# Altium project Urukul.PrjPCB (part 5 of 11)

## Sheet Urukul_FPGA.SchDoc: =DocumentName
size A3; DocumentNumber: 1; Revision: 0; SheetNumber: 16; SheetTotal: 20; Version: 1.6; Author 1: Grzegorz Kasprowicz; Author 2: Filip Światkowski, Paweł Kulik, Maciej Przybysz; Author 3: Krzysztof Belewicz; Github: https://github.com/sinara-hw/Urukul; Last modified by: Krzysztof Belewicz
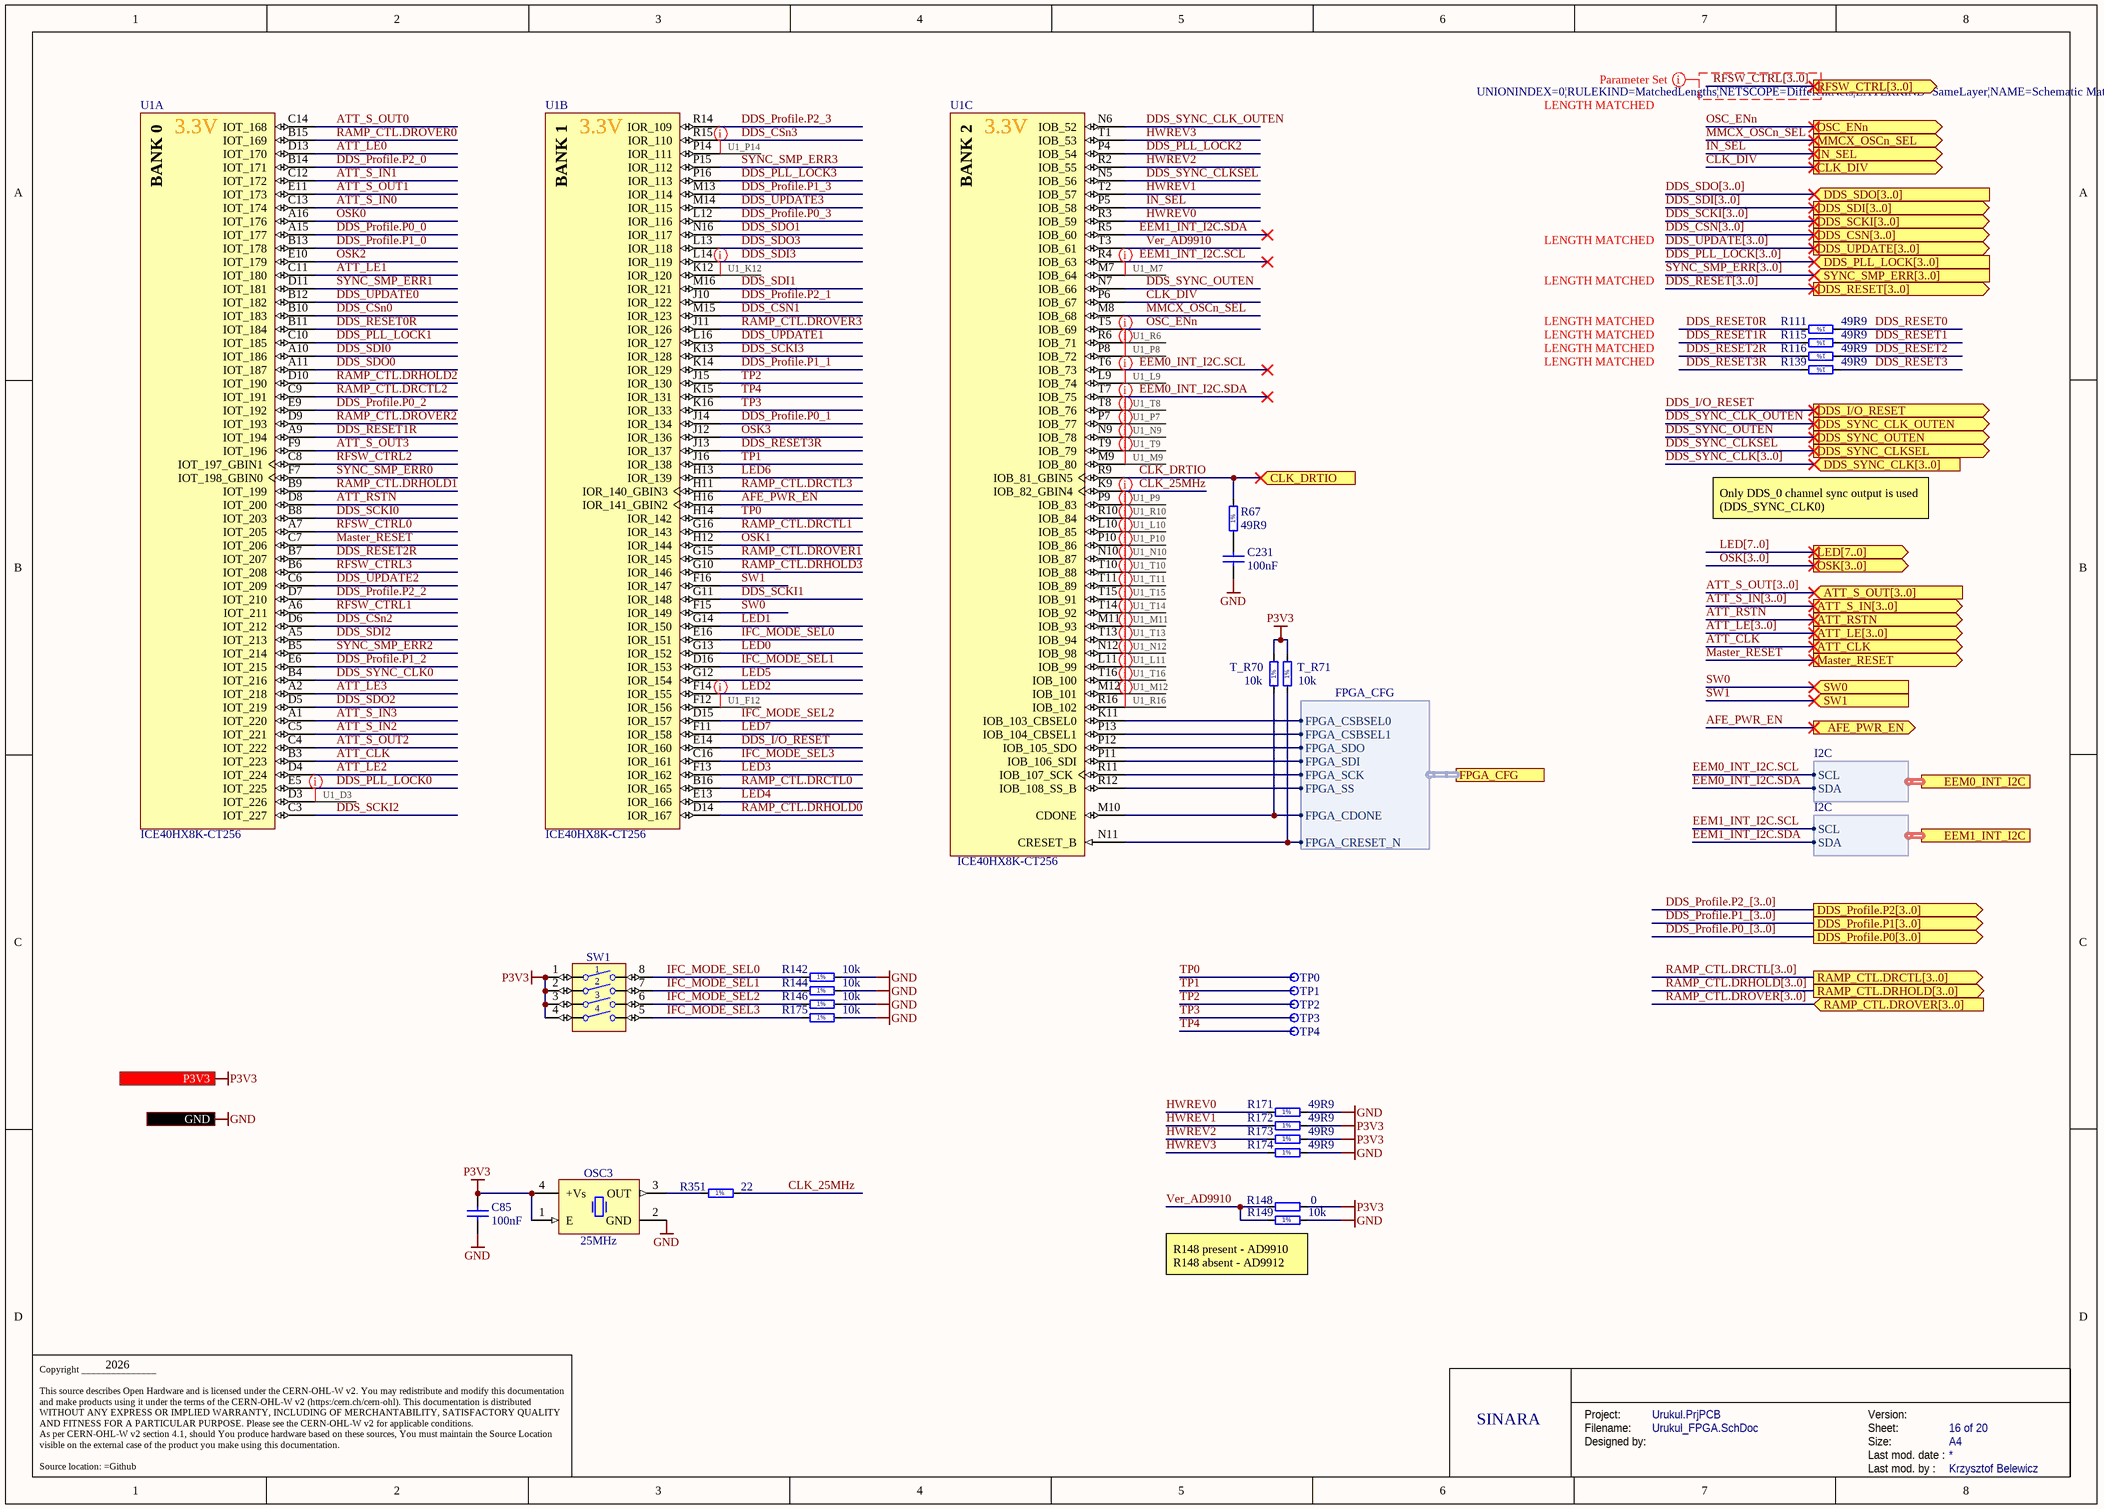
[diagram p11: Urukul_FPGA.SchDoc]

### Parts
C85  100nF  [CAPC1005X55N]
C231  100nF  [CAPC1005X55N]
OSC3  25MHz  [OSC_IQD_CFPS-39]
R67  49R9  [RESC1005X40N]
R111  49R9  [RESC1005X40N]
R115  49R9  [RESC1005X40N]
R116  49R9  [RESC1005X40N]
R139  49R9  [RESC1005X40N]
R142  10k  [RESC1005X40N]
R144  10k  [RESC1005X40N]
R146  10k  [RESC1005X40N]
R148  0  [RESC1005X40N]
R149  10k  [RESC1005X40N]
R171  49R9  [RESC1005X40N]
R172  49R9  [RESC1005X40N]
R173  49R9  [RESC1005X40N]
R174  49R9  [RESC1005X40N]
R175  10k  [RESC1005X40N]
R351  22  [RESC1005X40N]
SW1  Switch  [SW_TYCO_1571983-4]  (value not drawn)
T_R70  10k  [RESC1005X40N]
T_R71  10k  [RESC1005X40N]
TP0  Test Point  [TPS127]  (value not drawn)  (no BOM)
TP1  Test Point  [TPS127]  (value not drawn)  (no BOM)
TP2  Test Point  [TPS127]  (value not drawn)  (no BOM)
TP3  Test Point  [TPS127]  (value not drawn)  (no BOM)
TP4  Test Point  [TPS127]  (value not drawn)  (no BOM)
U1  ICE40HX8K-CT256  [LATC-caBGA-256]  (parts A,B,C of 5)

### Ports
AFE_PWR_EN (out), ATT_CLK (out), ATT_LE[3..0] (out), ATT_RSTN (out), ATT_S_IN[3..0] (out), ATT_S_OUT[3..0] (in), CLK_DIV (out), CLK_DRTIO (in), DDS_CSN[3..0] (out), DDS_I/O_RESET (out), DDS_PLL_LOCK[3..0] (in), DDS_Profile.P0[3..0] (out), DDS_Profile.P1[3..0] (out), DDS_Profile.P2[3..0] (out), DDS_RESET[3..0] (out), DDS_SCKI[3..0] (out), DDS_SDI[3..0] (out), DDS_SDO[3..0] (in), DDS_SYNC_CLK[3..0] (in), DDS_SYNC_CLK_OUTEN (out), DDS_SYNC_CLKSEL (out), DDS_SYNC_OUTEN (out), DDS_UPDATE[3..0] (out), EEM0_INT_I2C (harness I2C), EEM1_INT_I2C (harness I2C), FPGA_CFG (harness FPGA_CFG), GND, IN_SEL (out), LED[7..0] (out), Master_RESET (out), MMCX_OSCn_SEL (out), OSC_ENn (out), OSK[3..0] (out), P3V3 (in), RAMP_CTL.DRCTL[3..0] (out), RAMP_CTL.DRHOLD[3..0] (out), RAMP_CTL.DROVER[3..0] (in), RFSW_CTRL[3..0] (out), SW0 (in), SW1 (in), SYNC_SMP_ERR[3..0] (in)

### Harnesses
FPGA_CFG: FPGA_CSBSEL0, FPGA_CSBSEL1, FPGA_SDO, FPGA_SDI, FPGA_SCK, FPGA_SS, FPGA_CDONE, FPGA_CRESET_N
I2C: SDA, SCL

### Nets
GND: C85.1 C231.1 OSC3.2(GND) R142.1 R144.1 R146.1 R149.1 R171.1 R174.1 R175.1 ; port GND
P3V3: C85.2 OSC3.1(E) OSC3.4(+Vs) R148.2 R172.1 R173.1 SW1.1 SW1.2 SW1.3 SW1.4 T_R70.2 T_R71.2 ; port P3V3
AFE_PWR_EN: U1.H16(IOR_141_GBIN2) ; port AFE_PWR_EN
ATT_CLK: U1.B3(IOT_223) ; port ATT_CLK
ATT_LE0: U1.D13(IOT_170)
ATT_LE1: U1.C11(IOT_180)
ATT_LE2: U1.D4(IOT_224)
ATT_LE3: U1.A2(IOT_218)
ATT_RSTn: U1.D8(IOT_200) ; port ATT_RSTN
ATT_S_IN0: U1.C13(IOT_174)
ATT_S_IN1: U1.C12(IOT_172)
ATT_S_IN2: U1.C5(IOT_221)
ATT_S_IN3: U1.A1(IOT_220)
ATT_S_OUT0: U1.C14(IOT_168)
ATT_S_OUT1: U1.E11(IOT_173)
ATT_S_OUT2: U1.C4(IOT_222)
ATT_S_OUT3: U1.F9(IOT_196)
CLK_25MHz: R351.2 U1.K9(IOB_82_GBIN4)
CLK_DIV: U1.P6(IOB_67) ; port CLK_DIV
CLK_DRTIO: R67.2 U1.R9(IOB_81_GBIN5) ; port CLK_DRTIO
DDS_CSn0: U1.B10(IOT_183)  [project net CSN]
DDS_CSN1: U1.M15(IOR_123)  [project net CSN]
DDS_CSn2: U1.D6(IOT_212)  [project net CSN]
DDS_CSn3: U1.R15(IOR_110)  [project net CSN]
DDS_I/O_RESET: U1.E14(IOR_160) ; port DDS_I/O_RESET
DDS_PLL_LOCK0: U1.E5(IOT_225)
DDS_PLL_LOCK1: U1.C10(IOT_185)
DDS_PLL_LOCK2: U1.P4(IOB_54)
DDS_PLL_LOCK3: U1.P16(IOR_113)
DDS_Profile.P0_0: U1.A15(IOT_177)  [project net DDS_Profile.P00]
DDS_Profile.P0_1: U1.J14(IOR_134)  [project net DDS_Profile.P01]
DDS_Profile.P0_2: U1.E9(IOT_192)  [project net DDS_Profile.P02]
DDS_Profile.P0_3: U1.L12(IOR_116)  [project net DDS_Profile.P03]
DDS_Profile.P1_0: U1.B13(IOT_178)  [project net DDS_Profile.P10]
DDS_Profile.P1_1: U1.K14(IOR_129)  [project net DDS_Profile.P11]
DDS_Profile.P1_2: U1.E6(IOT_215)  [project net DDS_Profile.P12]
DDS_Profile.P1_3: U1.M13(IOR_114)  [project net DDS_Profile.P13]
DDS_Profile.P2_0: U1.B14(IOT_171)  [project net DDS_Profile.P20]
DDS_Profile.P2_1: U1.J10(IOR_122)  [project net DDS_Profile.P21]
DDS_Profile.P2_2: U1.D7(IOT_210)  [project net DDS_Profile.P22]
DDS_Profile.P2_3: U1.R14(IOR_109)  [project net DDS_Profile.P23]
DDS_RESET0: R111.1
DDS_RESET0R: R111.2 U1.B11(IOT_184)
DDS_RESET1: R115.1
DDS_RESET1R: R115.2 U1.A9(IOT_194)
DDS_RESET2: R116.1
DDS_RESET2R: R116.2 U1.B7(IOT_207)
DDS_RESET3: R139.1
DDS_RESET3R: R139.2 U1.J13(IOR_137)
DDS_SCKI0: U1.B8(IOT_203)
DDS_SCKI1: U1.G11(IOR_148)
DDS_SCKI2: U1.C3(IOT_227)
DDS_SCKI3: U1.K13(IOR_128)
DDS_SDI0: U1.A10(IOT_186)
DDS_SDI1: U1.M16(IOR_121)
DDS_SDI2: U1.A5(IOT_213)
DDS_SDI3: U1.L14(IOR_119)
DDS_SDO0: U1.A11(IOT_187)
DDS_SDO1: U1.N16(IOR_117)
DDS_SDO2: U1.D5(IOT_219)
DDS_SDO3: U1.L13(IOR_118)
DDS_SYNC_CLK0: U1.B4(IOT_216)
DDS_SYNC_CLK_OUTEN: U1.N6(IOB_52) ; port DDS_SYNC_CLK_OUTEN
DDS_SYNC_CLKSEL: U1.N5(IOB_56) ; port DDS_SYNC_CLKSEL
DDS_SYNC_OUTEN: U1.N7(IOB_66) ; port DDS_SYNC_OUTEN
DDS_UPDATE0: U1.B12(IOT_182)
DDS_UPDATE1: U1.L16(IOR_127)
DDS_UPDATE2: U1.C6(IOT_209)
DDS_UPDATE3: U1.M14(IOR_115)
EEM0_INT_I2C.SCL: U1.T6(IOB_73) ; port EEM0_INT_I2C.SCL
EEM0_INT_I2C.SDA: U1.T7(IOB_75) ; port EEM0_INT_I2C.SDA
EEM1_INT_I2C.SCL: U1.R4(IOB_63) ; port EEM1_INT_I2C.SCL
EEM1_INT_I2C.SDA: U1.R5(IOB_60) ; port EEM1_INT_I2C.SDA
FPGA_CDONE: T_R70.1 U1.M10(CDONE) ; port FPGA_CFG.FPGA_CDONE
FPGA_CFG.FPGA_CRESET_N: T_R71.1 U1.N11(CRESET_B) ; port FPGA_CFG.FPGA_CRESET_N
FPGA_CFG.FPGA_CSBSEL0: U1.K11(IOB_103_CBSEL0) ; port FPGA_CFG.FPGA_CSBSEL0
FPGA_CFG.FPGA_CSBSEL1: U1.P13(IOB_104_CBSEL1) ; port FPGA_CFG.FPGA_CSBSEL1
FPGA_CFG.FPGA_SCK: U1.R11(IOB_107_SCK) ; port FPGA_CFG.FPGA_SCK
FPGA_CFG.FPGA_SDI: U1.P11(IOB_106_SDI) ; port FPGA_CFG.FPGA_SDI
FPGA_CFG.FPGA_SDO: U1.P12(IOB_105_SDO) ; port FPGA_CFG.FPGA_SDO
FPGA_CFG.FPGA_SS: U1.R12(IOB_108_SS_B) ; port FPGA_CFG.FPGA_SS
HWREV0: R171.2 U1.R3(IOB_59)
HWREV1: R172.2 U1.T2(IOB_57)
HWREV2: R173.2 U1.R2(IOB_55)
HWREV3: R174.2 U1.T1(IOB_53)
IFC_MODE_SEL0: R142.2 SW1.8 U1.E16(IOR_151)
IFC_MODE_SEL1: R144.2 SW1.7 U1.D16(IOR_153)
IFC_MODE_SEL2: R146.2 SW1.6 U1.D15(IOR_157)
IFC_MODE_SEL3: R175.2 SW1.5 U1.C16(IOR_161)
IN_SEL: U1.P5(IOB_58) ; port IN_SEL
LED0: U1.G13(IOR_152)
LED1: U1.G14(IOR_150)
LED2: U1.F14(IOR_155)
LED3: U1.F13(IOR_162)
LED4: U1.E13(IOR_166)
LED5: U1.G12(IOR_154)
LED6: U1.H13(IOR_139)
LED7: U1.F11(IOR_158)
Master_RESET: U1.C7(IOT_206) ; port Master_RESET
MMCX_OSCn_SEL: U1.M8(IOB_68) ; port MMCX_OSCn_SEL
OSC_ENn: U1.T5(IOB_69) ; port OSC_ENn
OSK0: U1.A16(IOT_176)
OSK1: U1.H12(IOR_144)  [project net OSK01]
OSK2: U1.E10(IOT_179)  [project net OSK02]
OSK3: U1.J12(IOR_136)  [project net OSK03]
RAMP_CTL.DRCTL0: U1.B16(IOR_165)
RAMP_CTL.DRCTL1: U1.G16(IOR_143)
RAMP_CTL.DRCTL2: U1.C9(IOT_191)
RAMP_CTL.DRCTL3: U1.H11(IOR_140_GBIN3)
RAMP_CTL.DRHOLD0: U1.D14(IOR_167)
RAMP_CTL.DRHOLD1: U1.B9(IOT_199)
RAMP_CTL.DRHOLD2: U1.D10(IOT_190)
RAMP_CTL.DRHOLD3: U1.G10(IOR_146)
RAMP_CTL.DROVER0: U1.B15(IOT_169)
RAMP_CTL.DROVER1: U1.G15(IOR_145)
RAMP_CTL.DROVER2: U1.D9(IOT_193)
RAMP_CTL.DROVER3: U1.J11(IOR_126)
RFSW_CTRL0: U1.A7(IOT_205)
RFSW_CTRL1: U1.A6(IOT_211)
RFSW_CTRL2: U1.C8(IOT_197_GBIN1)
RFSW_CTRL3: U1.B6(IOT_208)
SW0: U1.F15(IOR_149) ; port SW0
SW1: U1.F16(IOR_147) ; port SW1
SYNC_SMP_ERR0: U1.F7(IOT_198_GBIN0)
SYNC_SMP_ERR1: U1.D11(IOT_181)
SYNC_SMP_ERR2: U1.B5(IOT_214)
SYNC_SMP_ERR3: U1.P15(IOR_112)
TP0: TP0.1 U1.H14(IOR_142)
TP1: TP1.1 U1.J16(IOR_138)
TP2: TP2.1 U1.J15(IOR_130)
TP3: TP3.1 U1.K16(IOR_133)
TP4: TP4.1 U1.K15(IOR_131)
U1_D3: U1.D3(IOT_226)
U1_F12: U1.F12(IOR_156)
U1_K12: U1.K12(IOR_120)
U1_L9: U1.L9(IOB_74)
U1_L10: U1.L10(IOB_85)
U1_L11: U1.L11(IOB_99)
U1_M7: U1.M7(IOB_64)
U1_M9: U1.M9(IOB_80)
U1_M11: U1.M11(IOB_93)
U1_M12: U1.M12(IOB_101)
U1_N9: U1.N9(IOB_78)
U1_N10: U1.N10(IOB_87)
U1_N12: U1.N12(IOB_98)
U1_P7: U1.P7(IOB_77)
U1_P8: U1.P8(IOB_72)
U1_P9: U1.P9(IOB_83)
U1_P10: U1.P10(IOB_86)
U1_P14: U1.P14(IOR_111)
U1_R6: U1.R6(IOB_71)
U1_R10: U1.R10(IOB_84)
U1_R16: U1.R16(IOB_102)
U1_T8: U1.T8(IOB_76)
U1_T9: U1.T9(IOB_79)
U1_T10: U1.T10(IOB_88)
U1_T11: U1.T11(IOB_89)
U1_T13: U1.T13(IOB_94)
U1_T14: U1.T14(IOB_92)
U1_T15: U1.T15(IOB_91)
U1_T16: U1.T16(IOB_100)
Ver_AD9910: R148.1 R149.2 U1.T3(IOB_61)
NetC231_2: C231.2 R67.1
NetOSC3_3: OSC3.3(OUT) R351.1

### Buses and harness runs
bus ATT_LE[3..0] = port ATT_LE[3..0]
bus ATT_S_IN[3..0] = port ATT_S_IN[3..0]
bus ATT_S_OUT[3..0] = port ATT_S_OUT[3..0]
bus DDS_CSN[3..0] = port DDS_CSN[3..0]
bus DDS_PLL_LOCK[3..0] = port DDS_PLL_LOCK[3..0]
bus DDS_Profile.P0_[3..0] = port DDS_Profile.P0[3..0]
bus DDS_Profile.P1_[3..0] = port DDS_Profile.P1[3..0]
bus DDS_Profile.P2_[3..0] = port DDS_Profile.P2[3..0]
bus DDS_RESET[3..0] = port DDS_RESET[3..0]
bus DDS_SCKI[3..0] = port DDS_SCKI[3..0]
bus DDS_SDI[3..0] = port DDS_SDI[3..0]
bus DDS_SDO[3..0] = port DDS_SDO[3..0]
bus DDS_SYNC_CLK[3..0] = port DDS_SYNC_CLK[3..0]
bus DDS_UPDATE[3..0] = port DDS_UPDATE[3..0]
bus LED[7..0] = port LED[7..0]
bus OSK[3..0] = port OSK[3..0]
bus RAMP_CTL.DRCTL[3..0] = port RAMP_CTL.DRCTL[3..0]
bus RAMP_CTL.DRHOLD[3..0] = port RAMP_CTL.DRHOLD[3..0]
bus RAMP_CTL.DROVER[3..0] = port RAMP_CTL.DROVER[3..0]
bus RFSW_CTRL[3..0] = port RFSW_CTRL[3..0]
bus SYNC_SMP_ERR[3..0] = port SYNC_SMP_ERR[3..0]

### Layout directives
rule Matched Net Lengths [Tolerance = 2.54mm]; net class RFSW: RFSW_CTRL[3..0]
net class Unused: U1_D3, U1_F12, U1_K12, U1_L9, U1_L10, U1_L11, U1_M7, U1_M9, U1_M11, U1_M12, U1_N9, U1_N10, U1_N12, U1_P7, U1_P8, U1_P9, U1_P10, U1_P14, U1_R6, U1_R10, U1_R16, U1_T8, U1_T9, U1_T10, U1_T11, U1_T13, U1_T14, U1_T15, U1_T16

### Notes on the sheet
- LENGTH MATCHED
- 3.3V
- Only DDS_0 channel sync output is used (DDS_SYNC_CLK0)
- (near R149) R148 present - AD9910
  R148 absent - AD9912
- 2026
- SINARA
- Project:
- Designed by:
- Filename:
- Size:
- Version:
- Last mod. date :
- Sheet:
- A4
- Copyright _______________
  This source describes Open Hardware and is licensed under the CERN-OHL-W v2. You may redistribute and modify this documentation and make products using it under the terms of the CERN-OHL-W v2 (https:/cern.ch/cern-ohl). This documentation is distributed WITHOUT ANY EXPRESS OR IMPLIED WARRANTY, INCLUDING OF MERCHANTABILITY, SATISFACTORY QUALITY AND FITNESS FOR A PARTICULAR PURPOSE. Please see the CERN-OHL-W v2 for applicable conditions.
  As per CERN-OHL-W v2 section 4.1, should You produce hardware based on these sources, You must maintain the Source Location visible on the external case of the product you make using this documentation.
  Source location: =Github
- Last mod. by :
- (in symbol CMP-0962-00001-1, part A) BANK 0
- (in symbol CMP-0962-00001-1, part B) BANK 1
- (in symbol CMP-0962-00001-1, part C) BANK 2
- (in symbol R0402_10K_1%_0.0625W_100PPM) 1%
- (in symbol R0402_22R_1%_0.0625W_100PPM) 1%
- (in symbol R0402_49R9_1%_0.0625W_100PPM) 1%

### Library data of the parts
C85 C231 = CC0402_100NF_16V_10%_X5R: Non-polarised capacitor; Part Description: SMD Multilayer Chip Ceramic Capacitor; Manufacturer: GENERIC; Manufacturer1 Part Number: GRM155R61C104KA88D; Voltage: 16V; TC: X5R; Tolerance: ±10%; Part Number: CC0402_100NF_16V_10%_X5R; Component Kind: Standard; Component Type: Standard; Pin Count: 2; Value: 100nF; Status: None; Manufacturer Part Number: CC0402_100NF_16V_10%_X5R; Case: 0402; Mounted: Yes; Socket: No; SMD: Yes; Sense: No; Manufacturer1 Example: MURATA; Manufacturer1 ComponentHeight: 0.55mm; HelpURL: \\cern.ch\dfs\Applications\Altium\Datasheets\CC0402_X5R_MURATA_GRM.pdf; Author: CERN DEM JLC; CreateDate: 10.12.2013; LatestRevisionDate: 10.12.2013
OSC3 = OSC_25MHZ_IQD_LFSPXO025165: Oscillator 4 pins 1=E 2=GND 3=OUT 4=+Vs; Part Description: 3.3V, ±50ppm, 15pF, -40 to 85°C, CMOS Surface Mount Clock Oscillator (CFPS-39 Series); Manufacturer: IQD FREQUENCY PRODUCTS; PressFit: No; Bonding: No; Part Number: OSC_25MHZ_IQD_LFSPXO025165; Component Kind: Standard; Component Type: Standard; PackageDescription: Oscillator, Corner Concave, 2.20mm Pitch, 4 Pins, 2.70mm L X 3.40mm W X 1.20mm H, CFPS-39 Series; Value: 25MHz; Manufacturer Part Number: LFSPXO025165; Pin Count: 4; Mounted: Yes; Socket: No; SMD: Yes; Sense: No; ComponentHeight: 1.2mm; HelpURL: \\cern.ch\dfs\Applications\Altium\Datasheets\OSC_IQD_LFSPXO025165.pdf; Author: CERN DEM JLC; CreateDate: 02.12.2010; LatestRevisionDate: 03.11.2016
R67 R111 R115 R116 R139 R171-R174 = R0402_49R9_1%_0.0625W_100PPM: Resistor - 1%; Part Description: General Purpose Thick Film Chip Resistor; Manufacturer: GENERIC; Manufacturer1 Part Number: 232270674999L or RC0402FR-0749R9L; TC: ±100ppm/°C; PressFit: No; Part Number: R0402_49R9_1%_0.0625W_100PPM; Component Kind: Standard; Component Type: Standard; Pin Count: 2; Value: 49R9; Status: Not Recommended; Power: 0.0625W; Tolerance: ±1%; Manufacturer Part Number: R0402_49R9_1%_0.0625W_100PPM; Case: 0402; Mounted: Yes; Sense: No; Socket: No; SMD: Yes; Manufacturer1 Example: YAGEO PHYCOMP; Manufacturer1 ComponentHeight: 0.4mm; HelpURL: \\cern.ch\dfs\Applications\Altium\Datasheets\R0402_Phycomp_RC0402.pdf; Author: CERN DEM JLC; CreateDate: 24.10.2012; LatestRevisionDate: 24.10.2012
R142 R144 R146 R149 R175 = R0402_10K_1%_0.0625W_100PPM: Resistor - 1%; Part Description: General Purpose Thick Film Chip Resistor; Manufacturer: GENERIC; Manufacturer1 Part Number: 232270671003L; TC: ±100ppm/°C; Part Number: R0402_10K_1%_0.0625W_100PPM; Component Kind: Standard; Component Type: Standard; Pin Count: 2; Value: 10k; Status: Not recommended; Power: 0.0625W; Tolerance: ±1%; Manufacturer Part Number: R0402_10K_1%_0.0625W_100PPM; Case: 0402; Mounted: Yes; Sense: No; Socket: No; SMD: Yes; Manufacturer1 Example: YAGEO PHYCOMP; Manufacturer1 ComponentHeight: 0.4mm; HelpURL: \\cern.ch\dfs\Applications\Altium\Datasheets\R0402_Phycomp_RC0402.pdf; Author: CERN DEM JLC; CreateDate: 03.12.2007; LatestRevisionDate: 17.10.2012
R148 = R0402_0R_JUMPER: Resistor; Part Description: 1A (0.05R Max DC Resistance) Zero Ohm Jumper; Manufacturer: GENERIC; Manufacturer1 Part Number: 232270591001L; Part Number: R0402_0R_JUMPER; Component Kind: Standard; Component Type: Standard; Pin Count: 2; Value: 0; Status: Not recommended; Manufacturer Part Number: R0402_0R_JUMPER; Case: 0402; Mounted: Yes; Sense: No; Socket: No; SMD: Yes; Manufacturer1 Example: YAGEO PHYCOMP; Manufacturer1 ComponentHeight: 0.4mm; HelpURL: \\cern.ch\dfs\Applications\Altium\Datasheets\R0402_Phycomp_RC0402.pdf; Author: CERN DEM JLC; CreateDate: 2007-12-03; LatestRevisionDate: 2012-10-17
R351 = R0402_22R_1%_0.0625W_100PPM: Resistor - 1%; Part Description: General Purpose Thick Film Chip Resistor; Manufacturer: GENERIC; Manufacturer1 Part Number: 232270672209L; TC: ±100ppm/°C; PressFit: No; Part Number: R0402_22R_1%_0.0625W_100PPM; Component Kind: Standard; Component Type: Standard; Pin Count: 2; Value: 22; Status: Not Recommended; Power: 0.0625W; Tolerance: ±1%; Manufacturer Part Number: R0402_22R_1%_0.0625W_100PPM; Case: 0402; Mounted: Yes; Sense: No; Socket: No; SMD: Yes; Manufacturer1 Example: YAGEO PHYCOMP; Manufacturer1 ComponentHeight: 0.4mm; HelpURL: \\cern.ch\dfs\Applications\Altium\Datasheets\R0402_Phycomp_RC0402.pdf; Author: CERN DEM JLC; CreateDate: 03/12/2007; LatestRevisionDate: 17/10/2012
SW1 = SW_TYCO_1571983-4: 4 Ways SPST DIP Switch; Part Description: 4 Way SPST SMD DIP Switch, Latched, Contact Rating 0.025A 24VDC; Manufacturer: TYCO; Manufacturer Part Number: 1571983-4 or GDH04S04; PressFit: No; Part Number: SW_TYCO_1571983-4; Component Kind: Standard; Component Type: Standard; Pin Count: 8; PackageDescription: Pitch 1.27mm,  Body 6.2x6.2mm, 4 Ways SPST Surface-Mount DIP Switch, TYCO GDH Series; Family: Switch; Mounted: Yes; Socket: No; SMD: Yes; Sense: No; Status: None; ComponentHeight: 2.31mm; HelpURL: \\cern.ch\dfs\Applications\Altium\Datasheets\SW_TYCO_1571983-4.pdf; Author: CERN DEM JLC; CreateDate: 08/01/2009; LatestRevisionDate: 08/01/2009
T_R70 T_R71 = R0402_10K_1%_0.0625W_100PPM: Resistor - 1%; Part Description: General Purpose Thick Film Chip Resistor; Manufacturer: GENERIC; Manufacturer1 Part Number: 232270671003L; TC: ±100ppm/°C; PressFit: No; Part Number: R0402_10K_1%_0.0625W_100PPM; Component Kind: Standard; Component Type: Standard; Pin Count: 2; Value: 10k; Status: Not Recommended; Power: 0.0625W; Tolerance: ±1%; Manufacturer Part Number: R0402_10K_1%_0.0625W_100PPM; Case: 0402; Mounted: Yes; Sense: No; Socket: No; SMD: Yes; Manufacturer1 Example: YAGEO PHYCOMP; Manufacturer1 ComponentHeight: 0.4mm; HelpURL: \\cern.ch\dfs\Applications\Altium\Datasheets\R0402_Phycomp_RC0402.pdf; Author: CERN DEM JLC; CreateDate: 03.12.2007; LatestRevisionDate: 17.10.2012
TP0-TP4 = SMD_PAD_1.27X1.27MM: Part Description: 1.27mm x 1.27mm PCB Copper Area (SMD Test Point); Mounted: No; Part Number: SMD_PAD_1.27X1.27MM; Component Type: Standard (No BOM); Pin Count: 1; Family: Test Point; Socket: No; SMD: Yes; Sense: No; Status: None; ComponentHeight: 0mm; HelpURL: Undefined; Author: CERN DEM JLC; CreateDate: 12.01.2008; LatestRevisionDate: 12.01.2008; PackageDescription: 1.27mm x 1.27mm PCB Copper Area (SMD Test Point)
U1 = CMP-0962-00001-1: iCE40 HX8K Series FPGA Family, 7680 Logic Cells, 1.2 V Core, 128 K Embedded RAM Bits, 256-ball caBGA, Pb-Free, Tray; Manufacturer: Lattice Semiconductor; Supply Voltage: 1.2V; Phase-Locked Loops: 2; Logic Cells: 7680; Embedded RAM Bits: 128K; PackageReference: caBGA-256; PackageDescription: 256-Ball Chip Array Ball Grid Array, Body 14 x 14 mm, Pitch 0.8 mm; RoHS: TRUE; Packing: Tray; Mounting Technology: Surface Mount; ComponentLink3URL: http://www.latticesemi.com/lit/docs/package/pkg.pdf; ComponentLink1Description: Manufacturer URL; ComponentLink3Description: Package Specification; Code_JEDEC: MO-275; PackageVersion: Rev. 03.9, 02/2013; ComponentLink1URL: http://www.latticesemi.com/en; ComponentLink2URL: http://www.latticesemi.com/~/media/Documents/DataSheets/iCE/iCE40LPHXFamilyDataSheet.pdf; Manufacturer Part Number: ICE40HX8K-CT256; ComponentLink2Description: Datasheet; DatasheetVersion: Rev. 02.9; Part Number: ICE40HX8K-CT256

## Sheet CLK_SYNC.SchDoc: =DocumentName
size A4; DocumentNumber: 1; Revision: 0; SheetNumber: 14; SheetTotal: 19; Version: 1.6; Author 1: Grzegorz Kasprowicz; Author 2: Filip Światkowski, Paweł Kulik, Maciej Przybysz; Author 3: Krzysztof Belewicz; Github: https://github.com/sinara-hw/Urukul; Last modified by: Maciej Przybysz
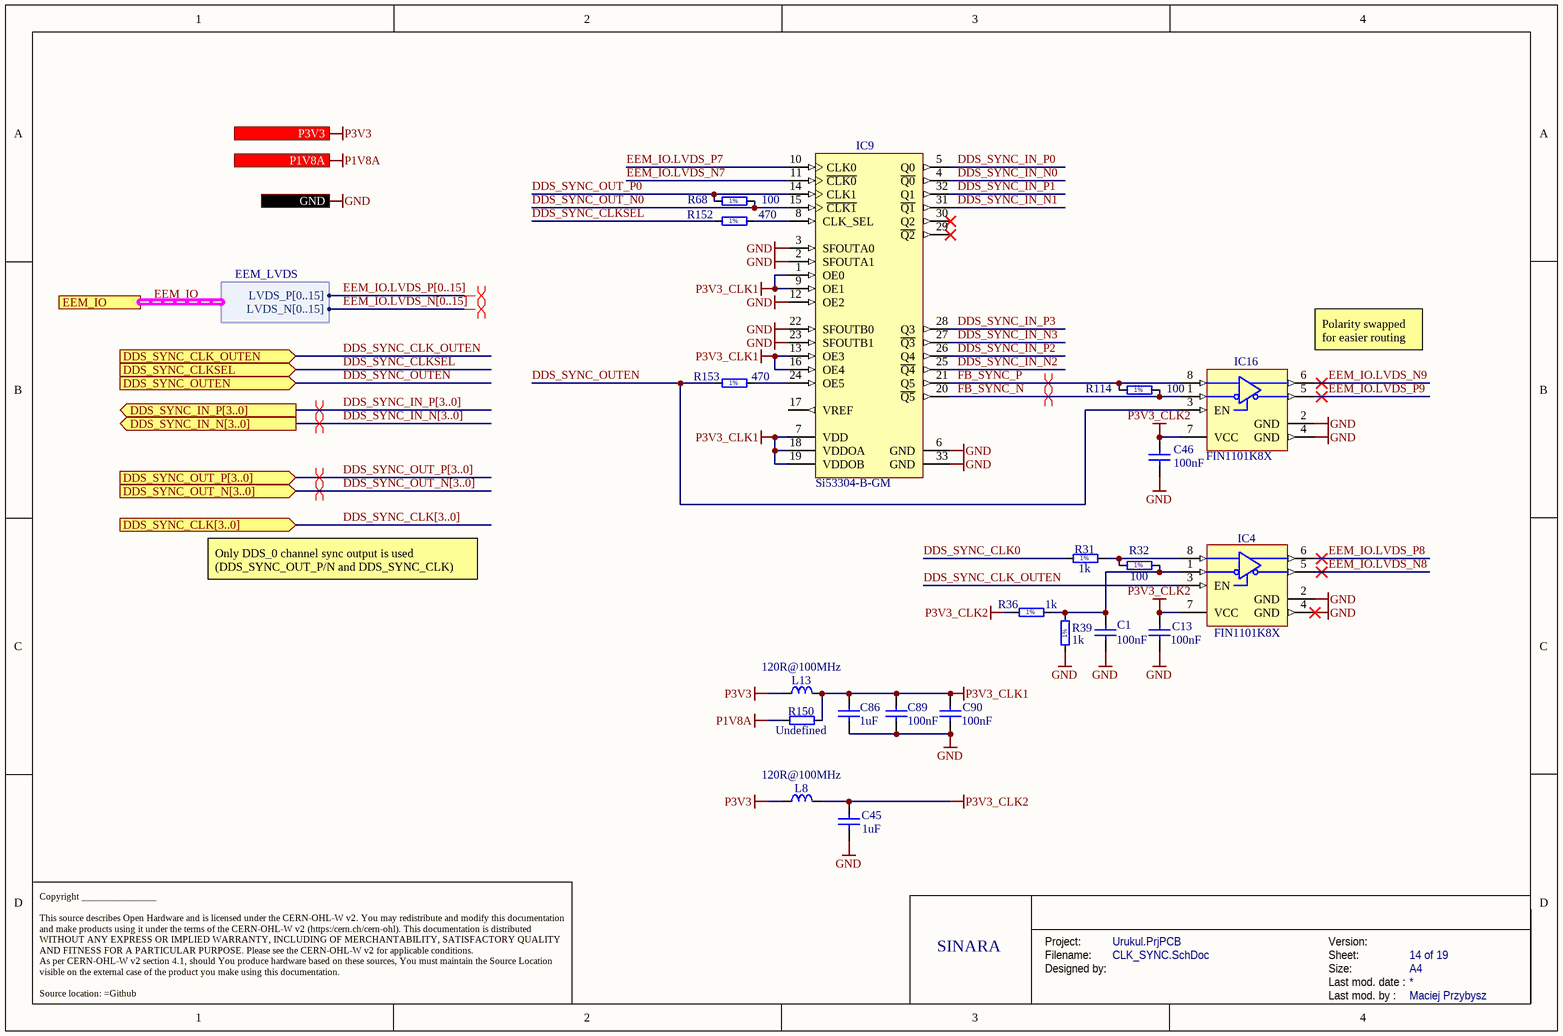
[diagram p12: CLK_SYNC.SchDoc]

### Parts
C1  100nF  [CAPC1005X55N]
C13  100nF  [CAPC1005X55N]
C45  1uF  [CAPC1005X55N]
C46  100nF  [CAPC1005X55N]
C86  1uF  [CAPC1005X55N]
C89  100nF  [CAPC1005X55N]
C90  100nF  [CAPC1005X55N]
IC4  FIN1101K8X  [SOP50P310X90-8N]
IC9  Si53304-B-GM  [SLAB-QFN-32-2150x2150TP_M]
IC16  FIN1101K8X  [SOP50P310X90-8N]
L8  120R@100MHz  [INDC1608X95N]
L13  120R@100MHz  [INDC1608X95N]
R31  1k  [RESC1005X40N]
R32  100  [RESC1005X40N]
R36  1k  [RESC1005X40N]
R39  1k  [RESC1005X40N]
R68  100  [RESC1005X40N]
R114  100  [RESC1005X40N]
R150  Undefined  [RESC1608X55N]
R152  470  [RESC1005X40N]
R153  470  [RESC1005X40N]

### Ports
DDS_SYNC_CLK[3..0] (in), DDS_SYNC_CLK_OUTEN (in), DDS_SYNC_CLKSEL (in), DDS_SYNC_IN_N[3..0] (out), DDS_SYNC_IN_P[3..0] (out), DDS_SYNC_OUT_N[3..0] (in), DDS_SYNC_OUT_P[3..0] (in), DDS_SYNC_OUTEN (in), EEM_IO (harness EEM_LVDS), GND, P1V8A (in), P3V3 (in)

### Harnesses
EEM_LVDS: LVDS_P[0..15], LVDS_N[0..15]

### Nets
GND: C1.1 C13.1 C45.1 C46.1 C86.1 C89.1 C90.1 IC4.2(GND) IC4.4(GND) IC9.2(SFOUTA1) IC9.3(SFOUTA0) IC9.6(GND) IC9.12(OE2) IC9.22(SFOUTB0) IC9.23(SFOUTB1) IC9.33(GND) IC16.2(GND) IC16.4(GND) R39.1 ; port GND
P1V8A: R150.1 ; port P1V8A
P3V3: L8.2 L13.2 ; port P3V3
P3V3_CLK1: C86.2 C89.2 C90.2 IC9.1(OE0) IC9.7(VDD) IC9.9(OE1) IC9.13(OE3) IC9.16(OE4) IC9.18(VDDOA) IC9.19(VDDOB) L13.1 R150.2
P3V3_CLK2: C13.2 C45.2 C46.2 IC4.7(VCC) IC16.7(VCC) L8.1 R36.1
DDS_SYNC_CLK0: R31.1
DDS_SYNC_CLK_OUTEN: IC4.3(EN) ; port DDS_SYNC_CLK_OUTEN
DDS_SYNC_CLKSEL: R152.1 ; port DDS_SYNC_CLKSEL
DDS_SYNC_IN_N0: IC9.4(~{Q0})
DDS_SYNC_IN_N1: IC9.31(~{Q1})
DDS_SYNC_IN_N2: IC9.25(~{Q4})
DDS_SYNC_IN_N3: IC9.27(~{Q3})
DDS_SYNC_IN_P0: IC9.5(Q0)
DDS_SYNC_IN_P1: IC9.32(Q1)
DDS_SYNC_IN_P2: IC9.26(Q4)
DDS_SYNC_IN_P3: IC9.28(Q3)
DDS_SYNC_OUT_N0: IC9.15(~{CLK1}) R68.2
DDS_SYNC_OUT_P0: IC9.14(CLK1) R68.1
DDS_SYNC_OUTEN: IC16.3(EN) R153.1 ; port DDS_SYNC_OUTEN
EEM_IO.LVDS_N7: IC9.11(~{CLK0})
EEM_IO.LVDS_N8: IC4.5(DOUT-)
EEM_IO.LVDS_N9: IC16.6(DOUT+)
EEM_IO.LVDS_P7: IC9.10(CLK0)
EEM_IO.LVDS_P8: IC4.6(DOUT+)
EEM_IO.LVDS_P9: IC16.5(DOUT-)
FB_SYNC_N: IC9.20(~{Q5}) IC16.1(RIN-) R114.2
FB_SYNC_P: IC9.21(Q5) IC16.8(RIN+) R114.1
NetC1_2: C1.2 IC4.1(RIN-) R32.2 R36.2 R39.2
NetIC4_8: IC4.8(RIN+) R31.2 R32.1
NetIC9_8: IC9.8(CLK_SEL) R152.2
NetIC9_24: IC9.24(OE5) R153.2

Not connected (* = marked no-connect by the designer): IC9 17(VREF) 29(~{Q2})* 30(Q2)*

### Buses and harness runs
bus DDS_SYNC_CLK[3..0] = port DDS_SYNC_CLK[3..0]
bus DDS_SYNC_IN_N[3..0] = port DDS_SYNC_IN_N[3..0]
bus DDS_SYNC_IN_P[3..0] = port DDS_SYNC_IN_P[3..0]
bus DDS_SYNC_OUT_N[3..0] = port DDS_SYNC_OUT_N[3..0]
bus DDS_SYNC_OUT_P[3..0] = port DDS_SYNC_OUT_P[3..0]
bus EEM_IO.LVDS_N[0..15]
bus EEM_IO.LVDS_P[0..15]
harness EEM_IO = port EEM_IO

### Layout directives
differential pair; differential pair class Diff_100Ohm: (no net found under the mark)
differential pair: (no net found under the mark), FB_SYNC_N, FB_SYNC_P

### Notes on the sheet
- (near IC16) Polarity swapped for easier routing
- Only DDS_0 channel sync output is used (DDS_SYNC_OUT_P/N and DDS_SYNC_CLK)
- SINARA
- Project:
- Designed by:
- Filename:
- Size:
- Version:
- Last mod. date :
- Sheet:
- A4
- Copyright _______________
  This source describes Open Hardware and is licensed under the CERN-OHL-W v2. You may redistribute and modify this documentation and make products using it under the terms of the CERN-OHL-W v2 (https:/cern.ch/cern-ohl). This documentation is distributed WITHOUT ANY EXPRESS OR IMPLIED WARRANTY, INCLUDING OF MERCHANTABILITY, SATISFACTORY QUALITY AND FITNESS FOR A PARTICULAR PURPOSE. Please see the CERN-OHL-W v2 for applicable conditions.
  As per CERN-OHL-W v2 section 4.1, should You produce hardware based on these sources, You must maintain the Source Location visible on the external case of the product you make using this documentation.
  Source location: =Github
- Last mod. by :
- (in symbol R0402_1K_1%_0.0625W_100PPM) 1%
- (in symbol R0402_100R_1%_0.0625W_100PPM) 1%
- (in symbol R0402_470R_1%_0.0625W_100PPM) 1%

### Library data of the parts
C1 C13 C46 C89 C90 = CC0402_100NF_16V_10%_X5R: as C85 on sheet Urukul_FPGA; Part Number: CC0402_100NF_16V_10%_X5R; Component Kind: Standard; Component Type: Standard; Pin Count: 2; Value: 100nF; Status: None; Manufacturer Part Number: CC0402_100NF_16V_10%_X5R; Case: 0402; Mounted: Yes; Socket: No; SMD: Yes; Sense: No; Manufacturer1 Example: MURATA; Manufacturer1 ComponentHeight: 0.55mm; HelpURL: \\cern.ch\dfs\Applications\Altium\Datasheets\CC0402_X5R_MURATA_GRM.pdf; Author: CERN DEM JLC; CreateDate: 10.12.2013; LatestRevisionDate: 10.12.2013
C45 C86 = CC0402_1UF_16V_10%_X5R: Non-polarised capacitor; Part Description: SMD Multilayer Chip Ceramic Capacitor; Manufacturer: GENERIC; Manufacturer1 Part Number: C1005X5R1C105KT; Voltage: 16V; TC: X5R; Tolerance: ±10%; Part Number: CC0402_1UF_16V_10%_X5R; Component Kind: Standard; Component Type: Standard; Pin Count: 2; Value: 1uF; Status: Preferred; Manufacturer Part Number: CC0402_1UF_16V_10%_X5R; Case: 0402; Mounted: Yes; Socket: No; SMD: Yes; Sense: No; Manufacturer1 Example: TDK; Manufacturer1 ComponentHeight: 0.55mm; HelpURL: \\cern.ch\dfs\Applications\Altium\Datasheets\CC0402_X5R_TDK_C.pdf; Author: CERN DEM JLC; CreateDate: 2012-10-25; LatestRevisionDate: 2012-10-25
IC4 IC16 = FIN1101K8X: LVDS Single Port High Speed Repeater; Manufacturer: FAIRCHILD SEMICONDUCTOR; PressFit: No; Bonding: No; Part Number: FIN1101K8X; Component Kind: Standard; Component Type: Standard; Device: FIN1101K8X; PackageDescription: SOP, 0.50mm Pitch; 8 pin, 2.30mm W X 2.00mm L X 0.90mm H body, PC Medium Density; Part Description: LVDS Single Port High Speed Repeater; Manufacturer Part Number: FIN1101K8X; Pin Count: 8; Case: TSSOP8; Mounted: Yes; Socket: No; SMD: Yes; Sense: No; ComponentHeight: 0.8mm; Author: CERN DEM JLC; HelpURL: \\cern.ch\dfs\Applications\Altium\Datasheets\FIN1101K8X.pdf; CreateDate: 08.11.2016; LatestRevisionDate: 08.11.2016
IC9 = CMP-0510-00277-1: 1:6 Low Jitter Universal Buffer / Level Translator with 2:1 Input Mux and Individual OE, 1 to 725 MHz, -40 to 85 degC, 32-pin QFN; Manufacturer: Silicon Labs; Sub-Family: Clock Buffers; Output Format: LVPECL; LVDS; CML; HCSL; LVCMOS; Frequency (MHz): 1 to 725; Mounting Technology: Surface Mount; Code_JEDEC: MO-220; Part Number: Si53304-B-GM; ComponentLink2URL: http://www.silabs.com/Support%20Documents/TechnicalDocs/Si53304.pdf; ComponentLink3URL: http://www.silabs.com/Support%20Documents/TechnicalDocs/Si53301.pdf; PackageDescription: 32-Pin Quad-Flat No-Leads Package, Body 5 x 5 mm, Pitch 0.5 mm; ComponentLink3Description: Package Specification; Code_IPC: J-STD-020; ComponentLink1Description: Manufacturer URL; ComponentLink2Description: Datasheet; ComponentLink1URL: http://www.silabs.com/; DatasheetVersion: Rev. 0.4; PackageReference: QFN-32
L8 L13 = IND0603_MURATA_BLM18PG121SN1D: Inductor; Part Description: SMD EMIFIL Chip Ferrite Bead; Manufacturer: MURATA; Power: 2A; Resistance: 0.05R; Part Number: IND0603_MURATA_BLM18PG121SN1D; Component Kind: Standard; Component Type: Standard; Pin Count: 2; Value: 120R@100MHz; Status: None; Manufacturer Part Number: BLM18PG121SN1D; Case: 0603; Mounted: Yes; Socket: No; SMD: Yes; Sense: No; ComponentHeight: 0.95mm; HelpURL: \\cern.ch\dfs\Applications\Altium\Datasheets\IND0603_MURATA_BLM18P.pdf; Author: CERN DEM BC; CreateDate: 2015-07-27; LatestRevisionDate: 2015-07-27
R31 R36 R39 = R0402_1K_1%_0.0625W_100PPM: Resistor - 1%; Part Description: General Purpose Thick Film Chip Resistor; Manufacturer: GENERIC; Manufacturer1 Part Number: 232270671002L; TC: ±100ppm/°C; PressFit: No; Part Number: R0402_1K_1%_0.0625W_100PPM; Component Kind: Standard; Component Type: Standard; Pin Count: 2; Value: 1k; Status: Not Recommended; Power: 0.0625W; Tolerance: ±1%; Manufacturer Part Number: R0402_1K_1%_0.0625W_100PPM; Case: 0402; Mounted: Yes; Socket: No; SMD: Yes; Manufacturer1 Example: YAGEO PHYCOMP; Manufacturer1 ComponentHeight: 0.4mm; HelpURL: \\cern.ch\dfs\Applications\Altium\Datasheets\R0402_Phycomp_RC0402.pdf; Author: CERN DEM JLC; CreateDate: 03.12.2007; LatestRevisionDate: 17.10.2012; Sense: No
R32 R68 R114 = R0402_100R_1%_0.0625W_100PPM: Resistor - 1%; Part Description: General Purpose Thick Film Chip Resistor; Manufacturer: GENERIC; Manufacturer1 Part Number: 232270671001L; TC: ±100ppm/°C; PressFit: No; Part Number: R0402_100R_1%_0.0625W_100PPM; Component Kind: Standard; Component Type: Standard; Pin Count: 2; Value: 100; Status: Not Recommended; Power: 0.0625W; Tolerance: ±1%; Manufacturer Part Number: R0402_100R_1%_0.0625W_100PPM; Case: 0402; Mounted: Yes; Sense: No; Socket: No; SMD: Yes; Manufacturer1 Example: YAGEO PHYCOMP; Manufacturer1 ComponentHeight: 0.4mm; HelpURL: \\cern.ch\dfs\Applications\Altium\Datasheets\R0402_Phycomp_RC0402.pdf; Author: CERN DEM JLC; CreateDate: 03.12.2007; LatestRevisionDate: 17.10.2012
R150 = R0603_NO-VALUE: Resistor; Part Description: Reserved Footprint For a 0603 (1608) Chip Resistor; PressFit: No; Mounted: No; Part Number: R0603_NO-VALUE; Component Kind: Standard; Component Type: Standard; Pin Count: 2; Value: Undefined; Status: None; Manufacturer: Undefined; Manufacturer Part Number: R0603_NO-VALUE; Case: 0603; Sense: No; Socket: No; SMD: Yes; Manufacturer1 Example: Undefined; Manufacturer1 Part Number: Undefined; Manufacturer1 ComponentHeight: Undefined; HelpURL: Undefined; Author: CERN DEM JLC; CreateDate: 03.12.2007; LatestRevisionDate: 13.03.2008
R152 R153 = R0402_470R_1%_0.0625W_100PPM: Resistor - 1%; Part Description: General Purpose Thick Film Chip Resistor; Manufacturer: GENERIC; Manufacturer1 Part Number: 232270674701L; TC: ±100ppm/°C; PressFit: No; Part Number: R0402_470R_1%_0.0625W_100PPM; Component Kind: Standard; Component Type: Standard; Pin Count: 2; Value: 470; Status: Not Recommended; Power: 0.0625W; Tolerance: ±1%; Manufacturer Part Number: R0402_470R_1%_0.0625W_100PPM; Case: 0402; Mounted: Yes; Sense: No; Socket: No; SMD: Yes; Manufacturer1 Example: YAGEO PHYCOMP; Manufacturer1 ComponentHeight: 0.4mm; HelpURL: \\cern.ch\dfs\Applications\Altium\Datasheets\R0402_Phycomp_RC0402.pdf; Author: CERN DEM JLC; CreateDate: 03.12.2007; LatestRevisionDate: 17.10.2012